# Altium schematic sheet Wifi-Bluetooth-Power.SchDoc
size A; SheetNumber: 12; SheetTotal: 16
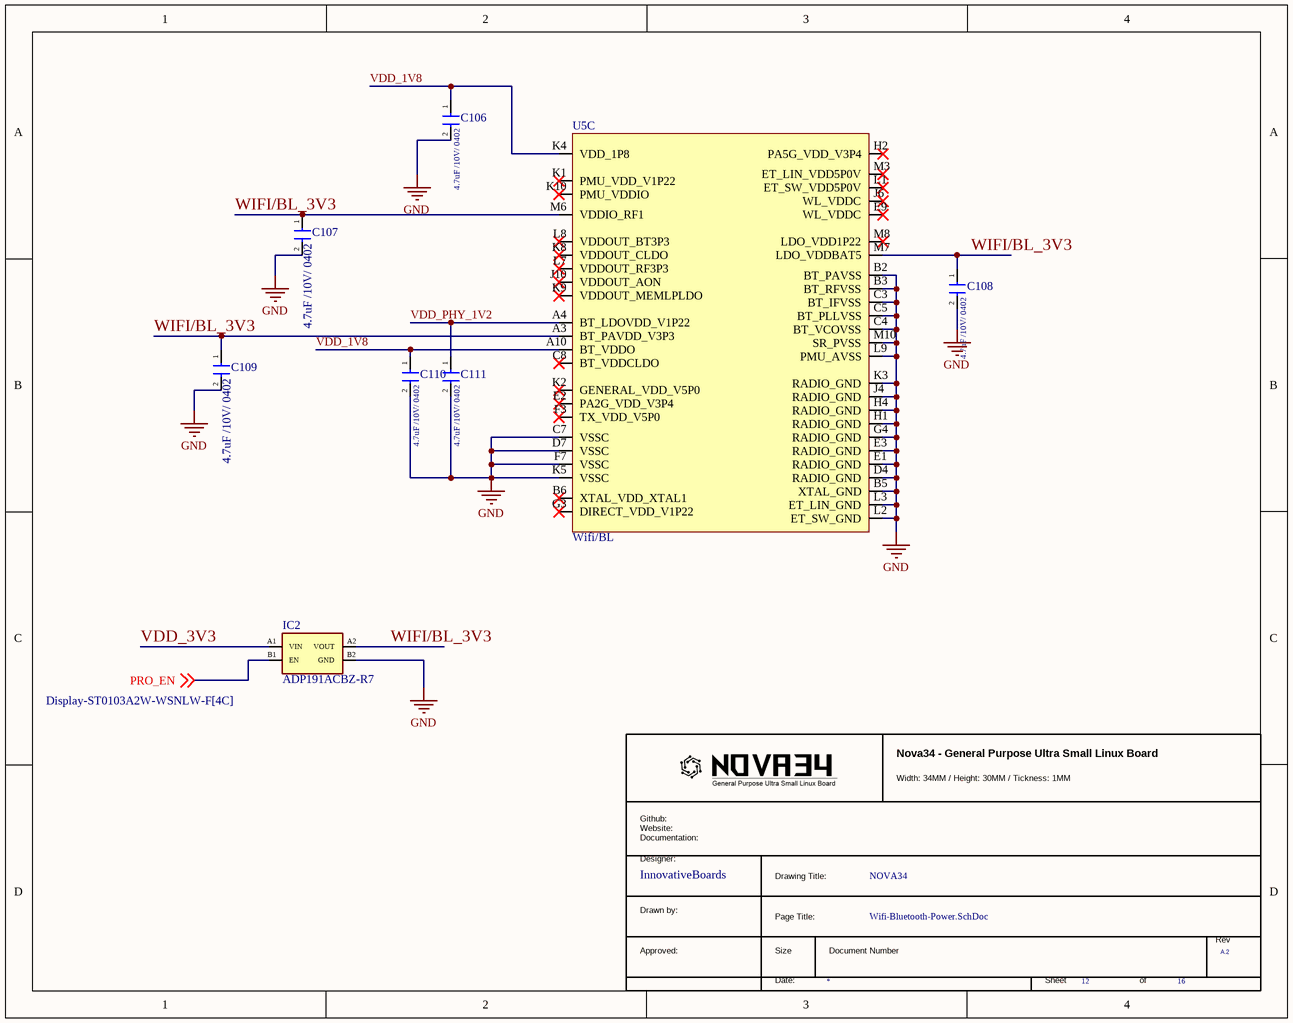
[diagram p0: Wifi-Bluetooth-Power.SchDoc]

## Parts
*  RevCode: A.2  (hidden comment: TitleBlock_MCPG)  (graphical)
C106  4.7uF /10V/ 0402  [CAPC1005X70N]
C107  4.7uF /10V/ 0402  [CAPC1005X70N]
C108  4.7uF /10V/ 0402  [CAPC1005X70N]
C109  4.7uF /10V/ 0402  [CAPC1005X70N]
C110  4.7uF /10V/ 0402  [CAPC1005X70N]
C111  4.7uF /10V/ 0402  [CAPC1005X70N]
IC2  ADP191ACBZ-R7  [BGA4C40P2X2_76X76X66]
U5  Wifi/BL  [106 BALL WLBGA 3.76X4.43X0.53 MM]  (part C of 3)

## Nets
GND: C106.2 C107.2 C108.2 C109.2 C110.2 C111.2 IC2.B2(GND) U5.B2(BT_PAVSS) U5.B3(BT_RFVSS) U5.B5(XTAL_GND) U5.C3(BT_IFVSS) U5.C4(BT_VCOVSS) U5.C5(BT_PLLVSS) U5.C7(VSSC) U5.D4(RADIO_GND) U5.D7(VSSC) U5.E1(RADIO_GND) U5.E3(RADIO_GND) U5.F7(VSSC) U5.G4(RADIO_GND) U5.H1(RADIO_GND) U5.H4(RADIO_GND) U5.J4(RADIO_GND) U5.K3(RADIO_GND) U5.K5(VSSC) U5.L2(ET_SW_GND) U5.L3(ET_LIN_GND) U5.L9(PMU_AVSS) U5.M10(SR_PVSS)
PRO_EN: IC2.B1(EN) ; off-sheet PRO_EN
VDD_1V8: C106.1 C110.1 U5.A10(BT_VDDO) U5.K4(VDD_1P8)
VDD_3V3: IC2.A1(VIN)
VDD_PHY_1V2: C111.1 U5.A4(BT_LDOVDD_V1P22)
WIFI/BL_3V3: C107.1 C108.1 C109.1 IC2.A2(VOUT) U5.A3(BT_PAVDD_V3P3) U5.M6(VDDIO_RF1) U5.M7(LDO_VDDBAT5)

Not connected (* = marked no-connect by the designer): U5 B6(XTAL_VDD_XTAL1)* C8(BT_VDDCLDO)* E2(PA2G_VDD_V3P4)* E9(WL_VDDC)* F3(TX_VDD_V5P0)* G3(DIRECT_VDD_V1P22)* H2(PA5G_VDD_V3P4)* J6(WL_VDDC)* J10(VDDOUT_AON)* K1(PMU_VDD_V1P22)* K2(GENERAL_VDD_V5P0)* K8(VDDOUT_CLDO)* K9(VDDOUT_MEMLPLDO)* K10(PMU_VDDIO)* L1(ET_SW_VDD5P0V)* L7(VDDOUT_RF3P3)* L8(VDDOUT_BT3P3)* M3(ET_LIN_VDD5P0V)* M8(LDO_VDD1P22)*

## Notes on the sheet
- (in symbol TitleBlock_MCPG) Nova34 - General Purpose Ultra Small Linux Board; Width: 34MM / Height: 30MM / Tickness: 1MM; Github: / Website: / Documentation:; Designer:; InnovativeBoards; Drawing Title:; NOVA34; Drawn by:; Page Title:; Rev; Approved:; Size; Document Number; Date:; Sheet; of

## Library data of the parts
C106-C111 = GRT155C81A475ME13J: Multilayer Ceramic Capacitors MLCC - SMD/SMT 0402 X6S 4.7 F 20 10VDC AEC-Q200; Manufacturer_Name: Murata Electronics; Datasheet Link: https://search.murata.co.jp/Ceramy/image/img/A01X/G101/ENG/GRT155C81A475ME13-01A.pdf; Height: 0.7mm; Manufacturer_Part_Number: GRT155C81A475ME13J; Mouser Part Number: 81-GRT155C81A475ME3J; Mouser Price/Stock: https://www.mouser.co.uk/ProductDetail/Murata-Electronics/GRT155C81A475ME13J?qs=ufv2HEpFn%252BS%252BPUDm1eQCHw%3D%3D
IC2 = ADP191ACBZ-R7: Integrated Circuit; Manufacturer_Name: Analog Devices; Manufacturer_Part_Number: ADP191ACBZ-R7; Mouser Part Number: 584-ADP191ACBZ-R7; Mouser Price/Stock: https://www.mouser.co.uk/ProductDetail/Analog-Devices/ADP191ACBZ-R7?qs=WIvQP4zGaniqVZQregMmwA%3D%3D; Arrow Part Number: ADP191ACBZ-R7; Arrow Price/Stock: https://www.arrow.com/en/products/adp191acbz-r7/analog-devices?region=nac
U5 = CYW43012
* = TitleBlock_MCPG: Page Create Date: March  8, 1995